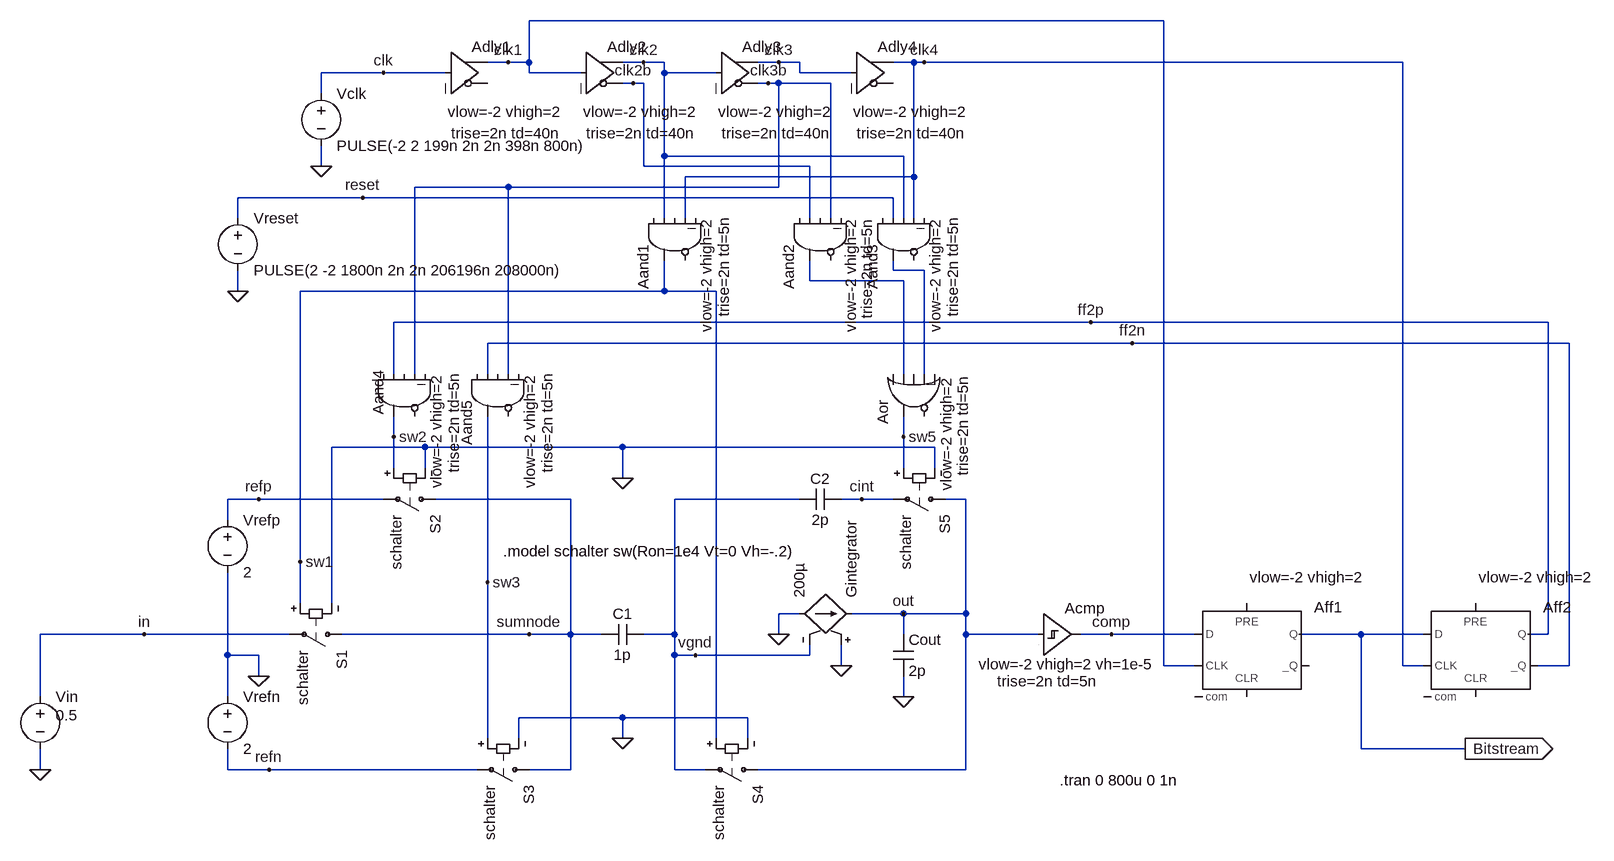
[diagram p0: schematic Oprescu.limitcycle.5_over_8.asc]
Oprescu.limitcycle.5_over_8.asc, the LTspice schematic file:
Version 4
SHEET 1 1680 1112
WIRE 992 -688 16 -688
WIRE -16 -624 -48 -624
WIRE 16 -624 16 -688
WIRE 16 -624 -16 -624
WIRE 192 -624 160 -624
WIRE 224 -624 192 -624
WIRE 400 -624 368 -624
WIRE 432 -624 400 -624
WIRE 608 -624 576 -624
WIRE 624 -624 608 -624
WIRE 1360 -624 624 -624
WIRE -208 -608 -304 -608
WIRE -112 -608 -208 -608
WIRE 16 -608 16 -624
WIRE 96 -608 16 -608
WIRE 224 -608 224 -624
WIRE 304 -608 224 -608
WIRE 432 -608 432 -624
WIRE 512 -608 432 -608
WIRE 176 -592 160 -592
WIRE 192 -592 176 -592
WIRE 384 -592 368 -592
WIRE 400 -592 384 -592
WIRE 480 -592 400 -592
WIRE -304 -576 -304 -608
WIRE 224 -480 224 -608
WIRE 592 -480 224 -480
WIRE -304 -464 -304 -496
WIRE 192 -464 192 -592
WIRE 448 -464 192 -464
WIRE 608 -448 608 -624
WIRE 608 -448 256 -448
WIRE -16 -432 -160 -432
WIRE 400 -432 400 -592
WIRE 400 -432 -16 -432
WIRE -240 -416 -432 -416
WIRE 576 -416 -240 -416
WIRE -432 -384 -432 -416
WIRE 224 -384 224 -480
WIRE 256 -384 256 -448
WIRE 448 -384 448 -464
WIRE 480 -384 480 -592
WIRE 576 -384 576 -416
WIRE 592 -384 592 -480
WIRE 608 -384 608 -448
WIRE 576 -304 576 -320
WIRE 624 -304 576 -304
WIRE 448 -288 448 -320
WIRE 592 -288 448 -288
WIRE -432 -272 -432 -304
WIRE 224 -272 224 -320
WIRE 224 -272 -336 -272
WIRE 304 -272 224 -272
WIRE 880 -224 -192 -224
WIRE 1584 -224 880 -224
WIRE 944 -192 -48 -192
WIRE 1616 -192 944 -192
WIRE -192 -144 -192 -224
WIRE -160 -144 -160 -432
WIRE -48 -144 -48 -192
WIRE -16 -144 -16 -432
WIRE 592 -144 592 -288
WIRE 624 -144 624 -304
WIRE -192 -48 -192 -80
WIRE 592 -48 592 -80
WIRE -144 -32 -288 -32
WIRE 160 -32 -144 -32
WIRE 640 -32 160 -32
WIRE -192 0 -192 -48
WIRE -144 0 -144 -32
WIRE 592 0 592 -48
WIRE 640 0 640 -32
WIRE 160 16 160 -32
WIRE -400 48 -448 48
WIRE -208 48 -400 48
WIRE 80 48 -128 48
WIRE 432 48 240 48
WIRE 528 48 496 48
WIRE 576 48 528 48
WIRE 688 48 656 48
WIRE -448 80 -448 48
WIRE -336 144 -336 -272
WIRE -48 176 -48 -80
WIRE -336 208 -336 144
WIRE -288 208 -288 -32
WIRE 432 224 400 224
WIRE 592 224 512 224
WIRE 688 224 688 48
WIRE 688 224 592 224
WIRE -576 256 -736 256
WIRE -352 256 -576 256
WIRE 16 256 -272 256
WIRE 80 256 80 48
WIRE 80 256 16 256
WIRE 128 256 80 256
WIRE 240 256 240 48
WIRE 240 256 192 256
WIRE 400 256 400 224
WIRE 592 256 592 224
WIRE 688 256 688 224
WIRE 800 256 688 256
WIRE 912 256 864 256
WIRE 1040 256 912 256
WIRE 1296 256 1200 256
WIRE 1392 256 1296 256
WIRE 1584 256 1584 -224
WIRE 1584 256 1552 256
WIRE -448 288 -448 160
WIRE -400 288 -448 288
WIRE 240 288 240 256
WIRE 272 288 240 288
WIRE 448 288 448 272
WIRE 448 288 272 288
WIRE 496 304 496 272
WIRE 992 304 992 -688
WIRE 1040 304 992 304
WIRE 1360 304 1360 -624
WIRE 1392 304 1360 304
WIRE 1616 304 1616 -192
WIRE 1616 304 1568 304
WIRE -400 320 -400 288
WIRE -736 352 -736 256
WIRE -448 352 -448 288
WIRE 592 352 592 320
WIRE 160 384 0 384
WIRE 352 384 160 384
WIRE -48 416 -48 176
WIRE 0 416 0 384
WIRE 160 416 160 384
WIRE 304 416 304 -272
WIRE 352 416 352 384
WIRE 1296 432 1296 256
WIRE 1456 432 1296 432
WIRE -736 464 -736 432
WIRE -448 464 -448 432
WIRE -384 464 -448 464
WIRE -64 464 -384 464
WIRE 80 464 80 256
WIRE 80 464 16 464
WIRE 240 464 240 288
WIRE 288 464 240 464
WIRE 688 464 688 256
WIRE 688 464 368 464
FLAG 496 304 0
FLAG 400 256 0
FLAG 160 16 0
FLAG 160 416 0
FLAG -400 320 0
FLAG -432 -272 0
FLAG -304 -464 0
FLAG -736 464 0
FLAG -208 -608 clk
FLAG -16 -624 clk1
FLAG 192 -624 clk2
FLAG 400 -624 clk3
FLAG 624 -624 clk4
FLAG 176 -592 clk2b
FLAG 384 -592 clk3b
FLAG -240 -416 reset
FLAG -576 256 in
FLAG 16 256 sumnode
FLAG 272 288 vgnd
FLAG 592 224 out
FLAG 912 256 comp
FLAG 880 -224 ff2p
FLAG 944 -192 ff2n
FLAG -336 144 sw1
FLAG -192 -48 sw2
FLAG -48 176 sw3
FLAG 592 -48 sw5
FLAG 528 48 cint
FLAG -400 48 refp
FLAG -384 464 refn
FLAG 592 352 0
FLAG 1456 432 Bitstream
IOPIN 1456 432 Out
SYMBOL sw -256 256 R90
WINDOW 3 24 104 Invisible 0
WINDOW 38 24 76 Left 0
SYMATTR Value ""
SYMATTR SpiceModel schalter
SYMATTR InstName S1
SYMBOL cap 192 240 R90
WINDOW 0 0 32 VBottom 0
WINDOW 3 32 32 VTop 0
SYMATTR InstName C1
SYMATTR Value 1p
SYMBOL sw -112 48 R90
WINDOW 3 24 104 Invisible 0
WINDOW 38 24 76 Left 0
SYMATTR Value ""
SYMATTR SpiceModel schalter
SYMATTR InstName S2
SYMBOL sw 32 464 R90
WINDOW 3 24 104 Invisible 0
WINDOW 38 24 76 Left 0
SYMATTR Value ""
SYMATTR SpiceModel schalter
SYMATTR InstName S3
SYMBOL sw 384 464 R90
WINDOW 3 24 104 Invisible 0
WINDOW 38 24 76 Left 0
SYMATTR Value ""
SYMATTR SpiceModel schalter
SYMATTR InstName S4
SYMBOL sw 672 48 R90
WINDOW 3 24 104 Invisible 0
WINDOW 38 24 76 Left 0
SYMATTR Value ""
SYMATTR SpiceModel schalter
SYMATTR InstName S5
SYMBOL cap 496 32 R90
WINDOW 0 0 32 VBottom 0
WINDOW 3 32 32 VTop 0
SYMATTR InstName C2
SYMATTR Value 2p
SYMBOL g 528 224 M270
SYMATTR InstName Gintegrator
SYMATTR Value 200µ
SYMBOL Digital\\schmtbuf 800 192 R0
WINDOW 3 -92 110 Left 0
WINDOW 123 -64 136 Left 0
SYMATTR Value vlow=-2 vhigh=2 vh=1e-5
SYMATTR Value2 trise=2n td=5n
SYMATTR InstName Acmp
SYMBOL Digital\\dflop 1120 208 R0
WINDOW 3 5 -40 Left 0
SYMATTR Value vlow=-2 vhigh=2
SYMATTR InstName Aff1
SYMBOL Digital\\buf -112 -672 R0
WINDOW 3 3 124 Left 0
WINDOW 123 8 157 Left 0
SYMATTR Value vlow=-2 vhigh=2
SYMATTR Value2 trise=2n td=40n
SYMATTR InstName Adly1
SYMBOL Digital\\buf 96 -672 R0
WINDOW 3 3 124 Left 0
WINDOW 123 8 157 Left 0
SYMATTR Value vlow=-2 vhigh=2
SYMATTR Value2 trise=2n td=40n
SYMATTR InstName Adly2
SYMBOL Digital\\buf 304 -672 R0
WINDOW 3 3 124 Left 0
WINDOW 123 8 157 Left 0
SYMATTR Value vlow=-2 vhigh=2
SYMATTR Value2 trise=2n td=40n
SYMATTR InstName Adly3
SYMBOL Digital\\and 176 -352 M90
WINDOW 3 -33 113 Left 0
WINDOW 123 -35 140 Left 0
SYMATTR Value vlow=-2 vhigh=2
SYMATTR Value2 trise=2n td=5n
SYMATTR InstName Aand1
SYMBOL Digital\\and 400 -352 M90
WINDOW 3 -33 111 Left 0
WINDOW 123 -32 136 Left 0
SYMATTR Value vlow=-2 vhigh=2
SYMATTR Value2 trise=2n td=5n
SYMATTR InstName Aand2
SYMBOL Digital\\buf 512 -672 R0
WINDOW 3 3 124 Left 0
WINDOW 123 8 157 Left 0
SYMATTR Value vlow=-2 vhigh=2
SYMATTR Value2 trise=2n td=40n
SYMATTR InstName Adly4
SYMBOL Digital\\or 544 -112 M90
WINDOW 3 -29 114 Left 0
WINDOW 123 -31 139 Left 0
SYMATTR Value vlow=-2 vhigh=2
SYMATTR Value2 trise=2n td=5n
SYMATTR InstName Aor
SYMBOL Digital\\and 528 -352 M90
WINDOW 3 -33 113 Left 0
WINDOW 123 -35 140 Left 0
SYMATTR Value vlow=-2 vhigh=2
SYMATTR Value2 trise=2n td=5n
SYMATTR InstName Aand3
SYMBOL Digital\\dflop 1472 208 R0
WINDOW 3 5 -40 Left 0
SYMATTR Value vlow=-2 vhigh=2
SYMATTR InstName Aff2
SYMBOL Digital\\and -240 -112 M90
WINDOW 0 -39 24 Left 0
WINDOW 3 -33 113 Left 0
WINDOW 123 -35 140 Left 0
SYMATTR InstName Aand4
SYMATTR Value vlow=-2 vhigh=2
SYMATTR Value2 trise=2n td=5n
SYMBOL Digital\\and -96 -112 M90
WINDOW 3 -33 113 Left 0
WINDOW 123 -35 140 Left 0
SYMATTR Value vlow=-2 vhigh=2
SYMATTR Value2 trise=2n td=5n
SYMATTR InstName Aand5
SYMBOL voltage -448 64 R0
SYMATTR InstName Vrefp
SYMATTR Value 2
SYMBOL voltage -448 336 R0
SYMATTR InstName Vrefn
SYMATTR Value 2
SYMBOL voltage -304 -592 R0
WINDOW 123 0 0 Left 0
WINDOW 39 0 0 Left 0
SYMATTR InstName Vclk
SYMATTR Value PULSE(-2 2 199n 2n 2n 398n 800n)
SYMBOL voltage -432 -400 R0
WINDOW 123 0 0 Left 0
WINDOW 39 0 0 Left 0
SYMATTR InstName Vreset
SYMATTR Value PULSE(2 -2 1800n 2n 2n 206196n 208000n)
SYMBOL voltage -736 336 R0
WINDOW 3 24 44 Left 0
WINDOW 123 0 0 Left 0
WINDOW 39 0 0 Left 0
SYMATTR InstName Vin
SYMATTR Value 0.5
SYMBOL cap 576 256 R0
SYMATTR InstName Cout
SYMATTR Value 2p
TEXT -24 128 Left 0 !.model schalter sw(Ron=1e4 Vt=0 Vh=-.2)
TEXT 832 480 Left 0 !.tran 0 800u 0 1n

The netlist it stands for:
* Oprescu.limitcycle.5_over_8.asc
S1 sumnode in sw1 0 schalter
C1 vgnd sumnode 1p
S2 sumnode refp sw2 0 schalter
S3 sumnode refn sw3 0 schalter
S4 out vgnd sw1 0 schalter
S5 out cint sw5 0 schalter
C2 cint vgnd 2p
Gintegrator 0 out 0 vgnd 200µ
Acmp out 0 0 0 0 0 comp 0 SCHMITT vlow=-2 vhigh=2 vh=1e-5 trise=2n td=5n
Aff1 comp 0 clk1 0 0 0 Bitstream 0 DFLOP vlow=-2 vhigh=2
Adly1 clk 0 0 0 0 0 clk1 0 BUF vlow=-2 vhigh=2 trise=2n td=40n
Adly2 clk1 0 0 0 0 clk2b clk2 0 BUF vlow=-2 vhigh=2 trise=2n td=40n
Adly3 clk2 0 0 0 0 clk3b clk3 0 BUF vlow=-2 vhigh=2 trise=2n td=40n
Aand1 0 clk2 0 clk4 0 0 sw1 0 AND vlow=-2 vhigh=2 trise=2n td=5n
Aand2 0 clk2b 0 clk3b 0 0 N002 0 AND vlow=-2 vhigh=2 trise=2n td=5n
Adly4 clk3 0 0 0 0 0 clk4 0 BUF vlow=-2 vhigh=2 trise=2n td=40n
Aor 0 N002 0 N001 0 0 sw5 0 OR vlow=-2 vhigh=2 trise=2n td=5n
Aand3 0 reset clk2 clk4 0 0 N001 0 AND vlow=-2 vhigh=2 trise=2n td=5n
Aff2 Bitstream 0 clk4 0 0 ff2n ff2p 0 DFLOP vlow=-2 vhigh=2
Aand4 0 ff2p 0 clk3b 0 0 sw2 0 AND vlow=-2 vhigh=2 trise=2n td=5n
Aand5 0 ff2n 0 clk3b 0 0 sw3 0 AND vlow=-2 vhigh=2 trise=2n td=5n
Vrefp refp 0 2
Vrefn 0 refn 2
Vclk clk 0 PULSE(-2 2 199n 2n 2n 398n 800n)
Vreset reset 0 PULSE(2 -2 1800n 2n 2n 206196n 208000n)
Vin in 0 0.5
Cout out 0 2p
.model schalter sw(Ron=1e4 Vt=0 Vh=-.2)
.tran 0 800u 0 1n
.backanno
.end